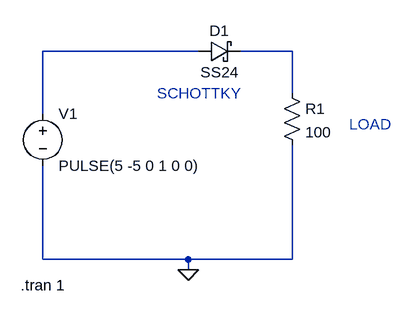
[diagram p0: schematic SIM.asc]
SIM.asc, the LTspice schematic file:
Version 4
SHEET 1 880 680
WIRE 176 -32 -64 -32
WIRE 320 -32 240 -32
WIRE 320 32 320 -32
WIRE -64 64 -64 -32
WIRE -64 288 -64 144
WIRE 160 288 -64 288
WIRE 320 288 320 112
WIRE 320 288 160 288
WIRE 160 304 160 288
FLAG 160 304 0
SYMBOL voltage -64 48 R0
WINDOW 123 0 0 Left 2
WINDOW 39 0 0 Left 2
SYMATTR InstName V1
SYMATTR Value PULSE(5 -5 0 1 0 0)
SYMBOL res 304 16 R0
SYMATTR InstName R1
SYMATTR Value 100
SYMBOL schottky 176 -16 R270
WINDOW 0 32 32 VTop 2
WINDOW 3 0 32 VBottom 2
SYMATTR InstName D1
SYMATTR Value SS24
SYMATTR Description Diode
SYMATTR Type diode
TEXT -98 328 Left 2 !.tran 1
TEXT 408 80 Left 2 ;LOAD
TEXT 112 32 Left 2 ;SCHOTTKY

The netlist it stands for:
* SIM.asc
V1 N001 0 PULSE(5 -5 0 1 0 0)
R1 N002 0 100
D1 N001 N002 SS24
.model D D
.lib standard.dio
.tran 1
* LOAD
* SCHOTTKY
.backanno
.end